# Altium schematic sheet vme_conn.SchDoc
size A4
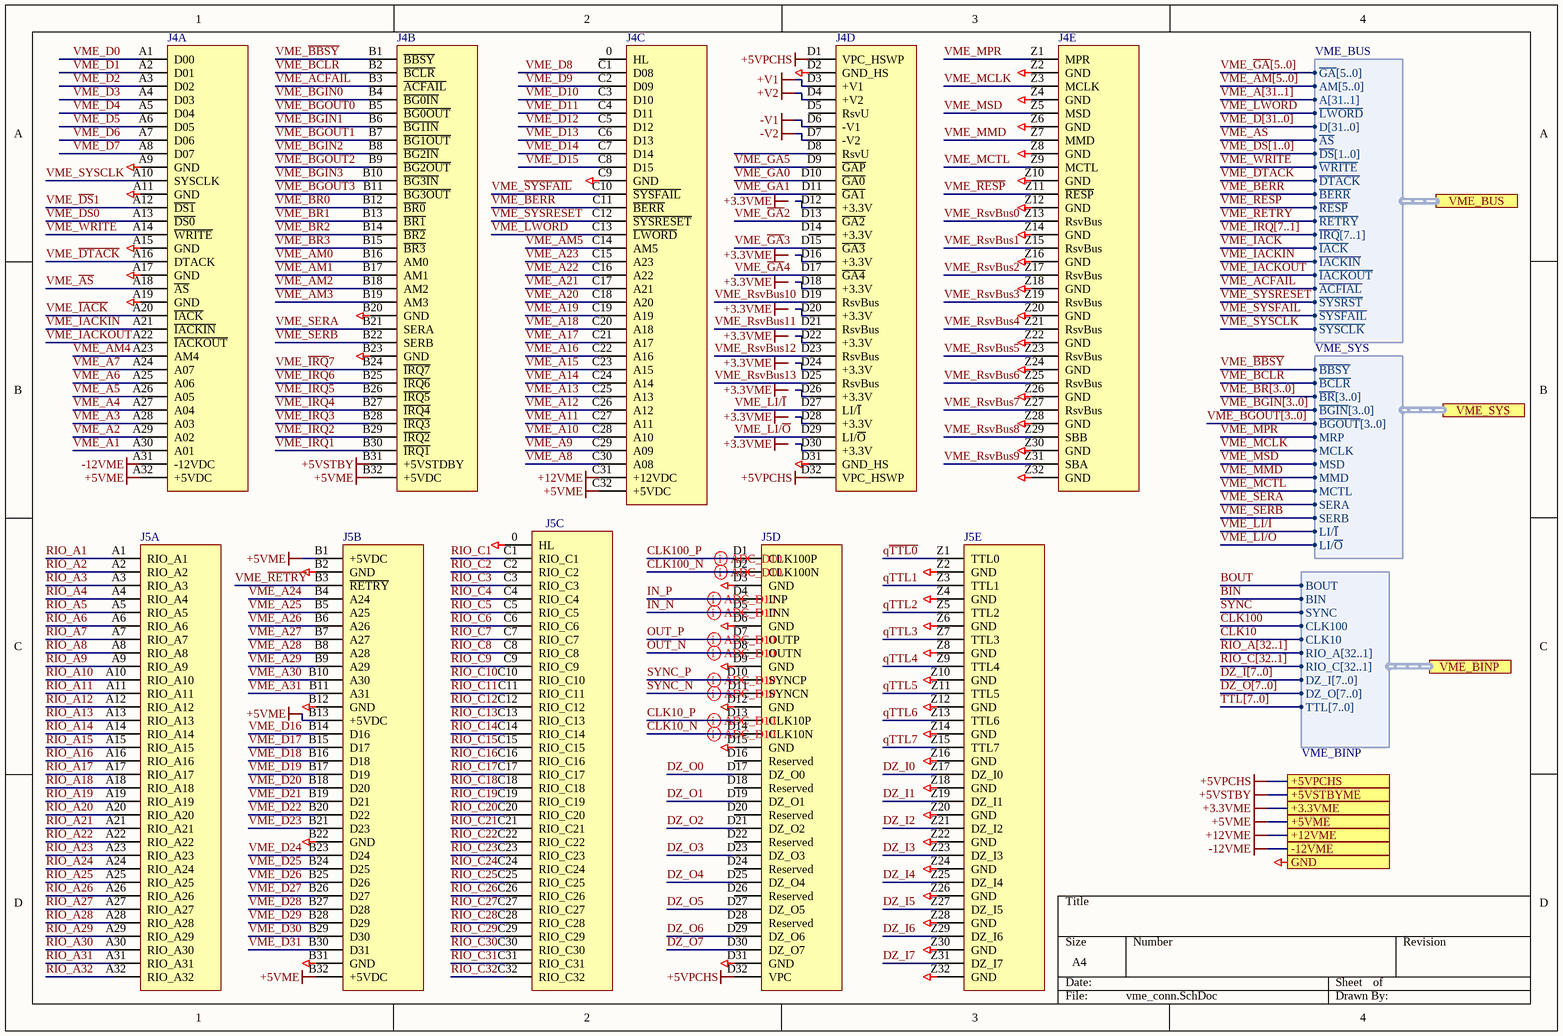
[diagram p0: vme_conn.SchDoc]

## Parts
J4  DIN41612_160MR  [DIN41612-160P]  (value not drawn)  (parts A,B,C,D,E of 5)
J5  DIN41612_160MR  [DIN41612-160P]  (value not drawn)  (parts A,B,C,D,E of 5)

## Ports
+3.3VME, +5VME, +5VPCHS, +5VSTBYME, +12VME, -12VME, GND, VME_BINP (harness VME_BINP), VME_BUS (harness VME_BUS), VME_SYS (harness VME_SYS)

## Harnesses
VME_BUS: ~{GA}[5..0], AM[5..0], A[31..1], D[31..0], ~{AS}, ~{IACK}, ~{IACKIN}, ~{SYSFAIL}, ~{IRQ}[7..1], ~{IACKOUT}, ~{DTACK}, ~{DS}[1..0], ~{SYSRST}, ~{WRITE}, ~{LWORD}, ~{SYSCLK}, ~{BERR}, ~{RESP}, ~{RETRY}, ~{ACFIAL}
VME_BINP: RIO_A[32..1], RIO_C[32..1], DZ_I[7..0], DZ_O[7..0], BOUT, BIN, SYNC, CLK100, CLK10, TTL[7..0]
VME_SYS: ~{BBSY}, ~{BCLR}, ~{BR}[3..0], ~{BGIN}[3..0], ~{BGOUT}[3..0], MRP, MCLK, MSD, MMD, MCTL, SERA, SERB, LI/~{I}, LI/~{O}

## Nets
+3.3VME: port +3.3VME
+5VME: J4.A32(+5VDC) J4.B32(+5VDC) J4.C32(+5VDC) J5.B1(+5VDC) J5.B13(+5VDC) J5.B32(+5VDC) ; port +5VME
+5VPCHS: J4.D1(VPC_HSWP) J4.D32(VPC_HSWP) J5.D32(VPC) ; port +5VPCHS
+5VSTBY: J4.B31(+5VSTDBY) ; port +5VSTBYME
+12VME: J4.C31(+12VDC) ; port +12VME
+V1: J4.D3(+V1)
+V2: J4.D4(+V2)
-12VME: J4.A31(-12VDC) ; port -12VME
-V1: J4.D6(-V1)
-V2: J4.D7(-V2)
GND: J4.A9(GND) J4.A11(GND) J4.A15(GND) J4.A17(GND) J4.A19(GND) J4.B20(GND) J4.B23(GND) J4.C9(GND) J4.D2(GND_HS) J4.D31(GND_HS) J4.Z2(GND) J4.Z4(GND) J4.Z6(GND) J4.Z8(GND) J4.Z10(GND) J4.Z12(GND) J4.Z14(GND) J4.Z16(GND) J4.Z18(GND) J4.Z20(GND) J4.Z22(GND) J4.Z24(GND) J4.Z26(GND) J4.Z28(GND) J4.Z30(GND) J4.Z32(GND) J5.0(HL) J5.B2(GND) J5.B12(GND) J5.B22(GND) J5.B31(GND) J5.D3(GND) J5.D6(GND) J5.D9(GND) J5.D12(GND) J5.D15(GND) J5.D31(GND) J5.Z2(GND) J5.Z4(GND) J5.Z6(GND) J5.Z8(GND) J5.Z10(GND) J5.Z12(GND) J5.Z14(GND) J5.Z16(GND) J5.Z18(GND) J5.Z20(GND) J5.Z22(GND) J5.Z24(GND) J5.Z26(GND) J5.Z28(GND) J5.Z30(GND) J5.Z32(GND) ; port GND
BIN: port VME_BINP.BIN
BOUT: port VME_BINP.BOUT
CLK10: port VME_BINP.CLK10
CLK10_N: J5.D14(CLK10N)
CLK10_P: J5.D13(CLK10P)
CLK100: port VME_BINP.CLK100
CLK100_N: J5.D2(CLK100N)
CLK100_P: J5.D1(CLK100P)
DZ_I0: J5.Z17(DZ_I0)
DZ_I1: J5.Z19(DZ_I1)
DZ_I2: J5.Z21(DZ_I2)
DZ_I3: J5.Z23(DZ_I3)
DZ_I4: J5.Z25(DZ_I4)
DZ_I5: J5.Z27(DZ_I5)
DZ_I6: J5.Z29(DZ_I6)
DZ_I7: J5.Z31(DZ_I7)
DZ_O0: J5.D17(DZ_O0)
DZ_O1: J5.D19(DZ_O1)
DZ_O2: J5.D21(DZ_O2)
DZ_O3: J5.D23(DZ_O3)
DZ_O4: J5.D25(DZ_O4)
DZ_O5: J5.D27(DZ_O5)
DZ_O6: J5.D29(DZ_O6)
DZ_O7: J5.D30(DZ_O7)
IN_N: J5.D5(INN)
IN_P: J5.D4(INP)
OUT_N: J5.D8(OUTN)
OUT_P: J5.D7(OUTP)
q~{TTL0}: J5.Z1(TTL0)
qTTL1: J5.Z3(TTL1)
qTTL2: J5.Z5(TTL2)
qTTL3: J5.Z7(TTL3)
qTTL4: J5.Z9(TTL4)
qTTL5: J5.Z11(TTL5)
qTTL6: J5.Z13(TTL6)
qTTL7: J5.Z15(TTL7)
RIO_A1: J5.A1(RIO_A1)
RIO_A2: J5.A2(RIO_A2)
RIO_A3: J5.A3(RIO_A3)
RIO_A4: J5.A4(RIO_A4)
RIO_A5: J5.A5(RIO_A5)
RIO_A6: J5.A6(RIO_A6)
RIO_A7: J5.A7(RIO_A7)
RIO_A8: J5.A8(RIO_A8)
RIO_A9: J5.A9(RIO_A9)
RIO_A10: J5.A10(RIO_A10)
RIO_A11: J5.A11(RIO_A11)
RIO_A12: J5.A12(RIO_A12)
RIO_A13: J5.A13(RIO_A13)
RIO_A14: J5.A14(RIO_A14)
RIO_A15: J5.A15(RIO_A15)
RIO_A16: J5.A16(RIO_A16)
RIO_A17: J5.A17(RIO_A17)
RIO_A18: J5.A18(RIO_A18)
RIO_A19: J5.A19(RIO_A19)
RIO_A20: J5.A20(RIO_A20)
RIO_A21: J5.A21(RIO_A21)
RIO_A22: J5.A22(RIO_A22)
RIO_A23: J5.A23(RIO_A23)
RIO_A24: J5.A24(RIO_A24)
RIO_A25: J5.A25(RIO_A25)
RIO_A26: J5.A26(RIO_A26)
RIO_A27: J5.A27(RIO_A27)
RIO_A28: J5.A28(RIO_A28)
RIO_A29: J5.A29(RIO_A29)
RIO_A30: J5.A30(RIO_A30)
RIO_A31: J5.A31(RIO_A31)
RIO_A32: J5.A32(RIO_A32)
RIO_C1: J5.C1(RIO_C1)
RIO_C2: J5.C2(RIO_C2)
RIO_C3: J5.C3(RIO_C3)
RIO_C4: J5.C4(RIO_C4)
RIO_C5: J5.C5(RIO_C5)
RIO_C6: J5.C6(RIO_C6)
RIO_C7: J5.C7(RIO_C7)
RIO_C8: J5.C8(RIO_C8)
RIO_C9: J5.C9(RIO_C9)
RIO_C10: J5.C10(RIO_C10)
RIO_C11: J5.C11(RIO_C11)
RIO_C12: J5.C12(RIO_C12)
RIO_C13: J5.C13(RIO_C13)
RIO_C14: J5.C14(RIO_C14)
RIO_C15: J5.C15(RIO_C15)
RIO_C16: J5.C16(RIO_C16)
RIO_C17: J5.C17(RIO_C17)
RIO_C18: J5.C18(RIO_C18)
RIO_C19: J5.C19(RIO_C19)
RIO_C20: J5.C20(RIO_C20)
RIO_C21: J5.C21(RIO_C21)
RIO_C22: J5.C22(RIO_C22)
RIO_C23: J5.C23(RIO_C23)
RIO_C24: J5.C24(RIO_C24)
RIO_C25: J5.C25(RIO_C25)
RIO_C26: J5.C26(RIO_C26)
RIO_C27: J5.C27(RIO_C27)
RIO_C28: J5.C28(RIO_C28)
RIO_C29: J5.C29(RIO_C29)
RIO_C30: J5.C30(RIO_C30)
RIO_C31: J5.C31(RIO_C31)
RIO_C32: J5.C32(RIO_C32)
SYNC: port VME_BINP.SYNC
SYNC_N: J5.D11(SYNCN)
SYNC_P: J5.D10(SYNCP)
VME_A1: J4.A30(A01)
VME_A2: J4.A29(A02)
VME_A3: J4.A28(A03)
VME_A4: J4.A27(A04)
VME_A5: J4.A26(A05)
VME_A6: J4.A25(A06)
VME_A7: J4.A24(A07)
VME_A8: J4.C30(A08)
VME_A9: J4.C29(A09)
VME_A10: J4.C28(A10)
VME_A11: J4.C27(A11)
VME_A12: J4.C26(A12)
VME_A13: J4.C25(A13)
VME_A14: J4.C24(A14)
VME_A15: J4.C23(A15)
VME_A16: J4.C22(A16)
VME_A17: J4.C21(A17)
VME_A18: J4.C20(A18)
VME_A19: J4.C19(A19)
VME_A20: J4.C18(A20)
VME_A21: J4.C17(A21)
VME_A22: J4.C16(A22)
VME_A23: J4.C15(A23)
VME_A24: J5.B4(A24)
VME_A25: J5.B5(A25)
VME_A26: J5.B6(A26)
VME_A27: J5.B7(A27)
VME_A28: J5.B8(A28)
VME_A29: J5.B9(A29)
VME_A30: J5.B10(A30)
VME_A31: J5.B11(A31)
VME_~{ACFAIL}: J4.B3(~{ACFAIL}) ; port VME_BUS.~{ACFIAL}
VME_~{AS}: J4.A18(~{AS}) ; port VME_BUS.~{AS}
VME_AM0: J4.B16(AM0)
VME_AM1: J4.B17(AM1)
VME_AM2: J4.B18(AM2)
VME_AM3: J4.B19(AM3)
VME_AM4: J4.A23(AM4)
VME_AM5: J4.C14(AM5)
VME_~{BBSY}: J4.B1(~{BBSY}) ; port VME_SYS.~{BBSY}
VME_~{BCLR}: J4.B2(~{BCLR}) ; port VME_SYS.~{BCLR}
VME_~{BERR}: J4.C11(~{BERR}) ; port VME_BUS.~{BERR}
VME_~{BGIN}0: J4.B4(~{BG0IN})
VME_~{BGIN}1: J4.B6(~{BG1IN})
VME_~{BGIN}2: J4.B8(~{BG2IN})
VME_~{BGIN}3: J4.B10(~{BG3IN})
VME_~{BGOUT}0: J4.B5(~{BG0OUT})
VME_~{BGOUT}1: J4.B7(~{BG1OUT})
VME_~{BGOUT}2: J4.B9(~{BG2OUT})
VME_~{BGOUT}3: J4.B11(~{BG3OUT})
VME_~{BR}0: J4.B12(~{BR0})
VME_~{BR}1: J4.B13(~{BR1})
VME_~{BR}2: J4.B14(~{BR2})
VME_~{BR}3: J4.B15(~{BR3})
VME_D0: J4.A1(D00)
VME_D1: J4.A2(D01)
VME_D2: J4.A3(D02)
VME_D3: J4.A4(D03)
VME_D4: J4.A5(D04)
VME_D5: J4.A6(D05)
VME_D6: J4.A7(D06)
VME_D7: J4.A8(D07)
VME_D8: J4.C1(D08)
VME_D9: J4.C2(D09)
VME_D10: J4.C3(D10)
VME_D11: J4.C4(D11)
VME_D12: J4.C5(D12)
VME_D13: J4.C6(D13)
VME_D14: J4.C7(D14)
VME_D15: J4.C8(D15)
VME_D16: J5.B14(D16)
VME_D17: J5.B15(D17)
VME_D18: J5.B16(D18)
VME_D19: J5.B17(D19)
VME_D20: J5.B18(D20)
VME_D21: J5.B19(D21)
VME_D22: J5.B20(D22)
VME_D23: J5.B21(D23)
VME_D24: J5.B23(D24)
VME_D25: J5.B24(D25)
VME_D26: J5.B25(D26)
VME_D27: J5.B26(D27)
VME_D28: J5.B27(D28)
VME_D29: J5.B28(D29)
VME_D30: J5.B29(D30)
VME_D31: J5.B30(D31)
VME_~{DS}0: J4.A13(~{DS0})
VME_~{DS}1: J4.A12(~{DS1})
VME_~{DTACK}: J4.A16(DTACK) ; port VME_BUS.~{DTACK}
VME_~{GA}0: J4.D10(~{GA0})
VME_~{GA}1: J4.D11(~{GA1})
VME_~{GA}2: J4.D13(~{GA2})
VME_~{GA}3: J4.D15(~{GA3})
VME_~{GA}4: J4.D17(~{GA4})
VME_~{GA}5: J4.D9(~{GAP})
VME_~{IACK}: J4.A20(~{IACK}) ; port VME_BUS.~{IACK}
VME_~{IACKIN}: J4.A21(~{IACKIN}) ; port VME_BUS.~{IACKIN}
VME_~{IACKOUT}: J4.A22(~{IACKOUT}) ; port VME_BUS.~{IACKOUT}
VME_~{IRQ}1: J4.B30(~{IRQ1})
VME_~{IRQ}2: J4.B29(~{IRQ2})
VME_~{IRQ}3: J4.B28(~{IRQ3})
VME_~{IRQ}4: J4.B27(~{IRQ4})
VME_~{IRQ}5: J4.B26(~{IRQ5})
VME_~{IRQ}6: J4.B25(~{IRQ6})
VME_~{IRQ}7: J4.B24(~{IRQ7})
VME_~{LWORD}: J4.C13(~{LWORD}) ; port VME_BUS.~{LWORD}
VME_LI/~{I}: J4.D27(LI/~{I}) ; port VME_SYS.LI/~{I}
VME_LI/~{O}: J4.D29(LI/~{O}) ; port VME_SYS.LI/~{O}
VME_MCLK: J4.Z3(MCLK) ; port VME_SYS.MCLK
VME_MCTL: J4.Z9(MCTL) ; port VME_SYS.MCTL
VME_MMD: J4.Z7(MMD) ; port VME_SYS.MMD
VME_MPR: J4.Z1(MPR) ; port VME_SYS.MRP
VME_MSD: J4.Z5(MSD) ; port VME_SYS.MSD
VME_~{RESP}: J4.Z11(~{RESP}) ; port VME_BUS.~{RESP}
VME_~{RETRY}: J5.B3(~{RETRY}) ; port VME_BUS.~{RETRY}
VME_RsvBus0: J4.Z13(RsvBus)
VME_RsvBus1: J4.Z15(RsvBus)
VME_RsvBus2: J4.Z17(RsvBus)
VME_RsvBus3: J4.Z19(RsvBus)
VME_RsvBus4: J4.Z21(RsvBus)
VME_RsvBus5: J4.Z23(RsvBus)
VME_RsvBus6: J4.Z25(RsvBus)
VME_RsvBus7: J4.Z27(RsvBus)
VME_RsvBus8: J4.Z29(SBB)
VME_RsvBus9: J4.Z31(SBA)
VME_RsvBus10: J4.D19(RsvBus)
VME_RsvBus11: J4.D21(RsvBus)
VME_RsvBus12: J4.D23(RsvBus)
VME_RsvBus13: J4.D25(RsvBus)
VME_~{SYSFAIL}: J4.C10(~{SYSFAIL}) ; port VME_BUS.~{SYSFAIL}
VME_~{SYSRESET}: J4.C12(~{SYSRESET}) ; port VME_BUS.~{SYSRST}
VME_SERA: J4.B21(SERA) ; port VME_SYS.SERA
VME_SERB: J4.B22(SERB) ; port VME_SYS.SERB
VME_SYSCLK: J4.A10(SYSCLK) ; port VME_BUS.~{SYSCLK}
VME_~{WRITE}: J4.A14(~{WRITE}) ; port VME_BUS.~{WRITE}

Not connected (* = marked no-connect by the designer): J4 0(HL) D5(RsvU) D8(RsvU) D12(+3.3V) D14(+3.3V) D16(+3.3V) D18(+3.3V) D20(+3.3V) D22(+3.3V) D24(+3.3V) D26(+3.3V) D28(+3.3V) D30(+3.3V); J5 D16(Reserved) D18(Reserved) D20(Reserved) D22(Reserved) D24(Reserved) D26(Reserved) D28(Reserved)

## Buses and harness runs
bus DZ_I[7..0]
bus DZ_O[7..0]
bus RIO_A[32..1]
bus RIO_C[32..1]
bus TTL[7..0]
bus VME_A[31..1]
bus VME_AM[5..0]
bus VME_D[31..0]
bus VME_~{BGIN}[3..0]
bus VME_~{BGOUT}[3..0]
bus VME_~{BR}[3..0]
bus VME_~{DS}[1..0]
bus VME_~{GA}[5..0]
bus VME_~{IRQ}[7..1]

## Layout directives
differential pair: CLK10_N, CLK10_P, CLK100_N, CLK100_P, IN_N, IN_P, OUT_N, OUT_P, SYNC_N, SYNC_P

## Notes on the sheet
- Labels drawn without touching a wire or pin: +3.3VME

## Library data of the parts
J4 = VME_P1_160MR: DIN 41612 5x32pin right angle male conector. VME P1 system connector; Vendor: HARTING; SolderOption: 0; Vendor_Id: 09 03 196 6921; Pin_Count: 160; Pkg: TH 160pin; PartField: DIN41612_160MR; Value: VME_P1_160MR; HelpURL: https://ru.mouser.com/Search/Refine?Keyword=617-09-03-196-6921; Supplier: https://ru.mouser.com/; Supplier_ID: 617-09-03-196-6921; SMD Solders: 0; THD Solders: 160
J5 = VME_P2_160MR_BINP_V0: DIN 41612 5x32pin right angle male conector. VME P2 system connector, VME BINP synch support; Vendor: HARTING; SolderOption: 0; Vendor_Id: 09 03 196 6921; Pin_Count: 160; Pkg: TH 160pin; PartField: DIN41612_160MR; Value: VME_P2_160MR; HelpURL: https://ru.mouser.com/Search/Refine?Keyword=617-09-03-196-6921; Supplier: https://ru.mouser.com/; Supplier_ID: 617-09-03-196-6921; SMD Solders: 0; THD Solders: 160